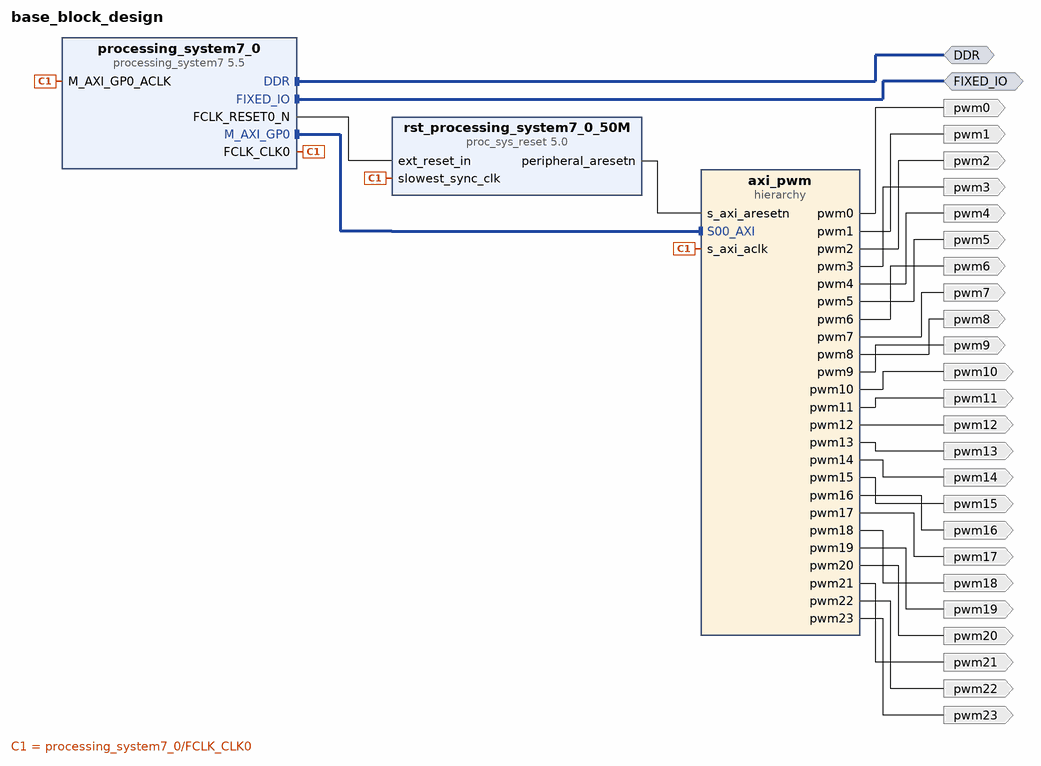
[diagram p0: block diagram of the top level]
# Vivado block design base_block_design, xc7z020clg400-3, Vivado 2018.2.1
create_bd_design base_block_design

create_bd_intf_port -mode Master -vlnv xilinx.com:interface:ddrx_rtl:1.0 DDR
create_bd_intf_port -mode Master -vlnv xilinx.com:display_processing_system7:fixedio_rtl:1.0 FIXED_IO
create_bd_port -dir O pwm0
create_bd_port -dir O pwm1
create_bd_port -dir O pwm2
create_bd_port -dir O pwm3
create_bd_port -dir O pwm4
create_bd_port -dir O pwm5
create_bd_port -dir O pwm6
create_bd_port -dir O pwm7
create_bd_port -dir O pwm8
create_bd_port -dir O pwm9
create_bd_port -dir O pwm10
create_bd_port -dir O pwm11
create_bd_port -dir O pwm12
create_bd_port -dir O pwm13
create_bd_port -dir O pwm14
create_bd_port -dir O pwm15
create_bd_port -dir O pwm16
create_bd_port -dir O pwm17
create_bd_port -dir O pwm18
create_bd_port -dir O pwm19
create_bd_port -dir O pwm20
create_bd_port -dir O pwm21
create_bd_port -dir O pwm22
create_bd_port -dir O pwm23

create_bd_cell -type hier axi_pwm
create_bd_cell -type ip -vlnv xilinx.com:ip:processing_system7:5.5 processing_system7_0
set_property -dict [list \
  CONFIG.PCW_UIPARAM_DDR_FREQ_MHZ 400 \
  CONFIG.PCW_CPU_CPU_6X4X_MAX_RANGE 867 \
  CONFIG.PCW_APU_PERIPHERAL_FREQMHZ 866.666666 \
  CONFIG.PCW_SDIO_PERIPHERAL_FREQMHZ 100 \
  CONFIG.PCW_UART_PERIPHERAL_FREQMHZ 100 \
  CONFIG.PCW_FPGA0_PERIPHERAL_FREQMHZ 50 \
  CONFIG.PCW_FPGA1_PERIPHERAL_FREQMHZ 50 \
  CONFIG.PCW_PERIPHERAL_BOARD_PRESET None \
  CONFIG.PCW_PRESET_BANK0_VOLTAGE {LVCMOS 1.8V} \
  CONFIG.PCW_PRESET_BANK1_VOLTAGE {LVCMOS 1.8V} \
  CONFIG.PCW_UIPARAM_DDR_MEMORY_TYPE {LPDDR 2} \
  CONFIG.PCW_UIPARAM_DDR_PARTNO Custom \
  CONFIG.PCW_QSPI_PERIPHERAL_ENABLE 1 \
  CONFIG.PCW_QSPI_QSPI_IO {MIO 1 .. 6} \
  CONFIG.PCW_QSPI_GRP_SINGLE_SS_ENABLE 1 \
  CONFIG.PCW_QSPI_GRP_SINGLE_SS_IO {MIO 1 .. 6} \
  CONFIG.PCW_SINGLE_QSPI_DATA_MODE NA \
  CONFIG.PCW_ENET0_PERIPHERAL_ENABLE 0 \
  CONFIG.PCW_SD0_PERIPHERAL_ENABLE 1 \
  CONFIG.PCW_SD0_SD0_IO {MIO 40 .. 45} \
  CONFIG.PCW_SD0_GRP_CD_ENABLE 0 \
  CONFIG.PCW_SD0_GRP_WP_ENABLE 0 \
  CONFIG.PCW_SD1_PERIPHERAL_ENABLE 1 \
  CONFIG.PCW_SD1_SD1_IO {MIO 10 .. 15} \
  CONFIG.PCW_UART0_PERIPHERAL_ENABLE 1 \
  CONFIG.PCW_UART0_UART0_IO {MIO 50 .. 51} \
  CONFIG.PCW_UART1_PERIPHERAL_ENABLE 0 \
  CONFIG.PCW_SPI1_PERIPHERAL_ENABLE 1 \
  CONFIG.PCW_SPI1_SPI1_IO {MIO 46 .. 51} \
  CONFIG.PCW_USB0_PERIPHERAL_ENABLE 0 \
  CONFIG.PCW_USB_RESET_ENABLE 1 \
  CONFIG.PCW_I2C_RESET_ENABLE 1 \
  CONFIG.PCW_GPIO_MIO_GPIO_ENABLE 1 \
  CONFIG.PCW_GPIO_MIO_GPIO_IO MIO \
  CONFIG.PCW_GPIO_EMIO_GPIO_ENABLE 1 \
  CONFIG.PCW_GPIO_EMIO_GPIO_IO 64 \
  CONFIG.PCW_UIPARAM_GENERATE_SUMMARY NONE \
] [get_bd_cells processing_system7_0]
# 510 more settings of processing_system7_0 are not shown: defaults, MIO pin electricals, DDR timing, and values the tool derives
create_bd_cell -type ip -vlnv xilinx.com:ip:proc_sys_reset:5.0 rst_processing_system7_0_50M

# ---- hierarchy /axi_pwm ----
current_bd_instance /axi_pwm
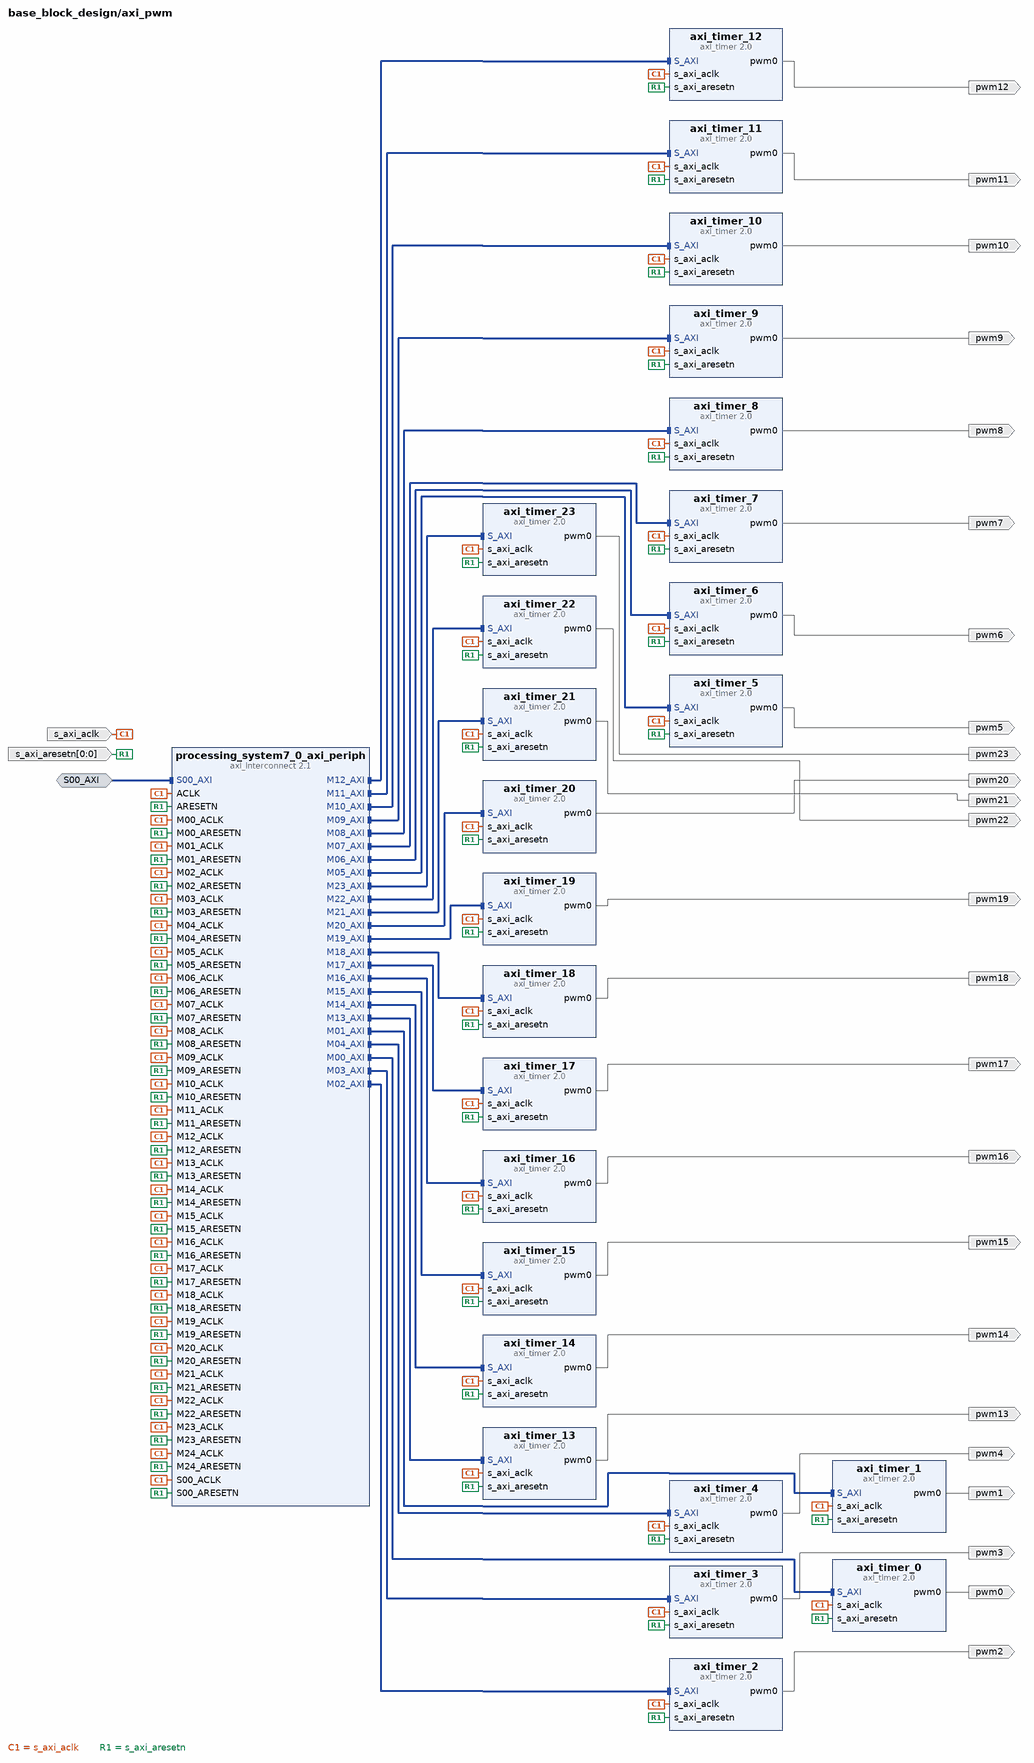
[diagram p1: block diagram inside /axi_pwm]
create_bd_intf_pin -mode Slave -vlnv xilinx.com:interface:aximm_rtl:1.0 S00_AXI
create_bd_pin -dir I -type clk s_axi_aclk
create_bd_pin -dir I -from 0 -to 0 -type rst s_axi_aresetn
create_bd_pin -dir O pwm0
create_bd_pin -dir O pwm1
create_bd_pin -dir O pwm2
create_bd_pin -dir O pwm3
create_bd_pin -dir O pwm10
create_bd_pin -dir O pwm11
create_bd_pin -dir O pwm12
create_bd_pin -dir O pwm13
create_bd_pin -dir O pwm14
create_bd_pin -dir O pwm15
create_bd_pin -dir O pwm16
create_bd_pin -dir O pwm17
create_bd_pin -dir O pwm18
create_bd_pin -dir O pwm19
create_bd_pin -dir O pwm20
create_bd_pin -dir O pwm21
create_bd_pin -dir O pwm4
create_bd_pin -dir O pwm5
create_bd_pin -dir O pwm6
create_bd_pin -dir O pwm22
create_bd_pin -dir O pwm23
create_bd_pin -dir O pwm7
create_bd_pin -dir O pwm8
create_bd_pin -dir O pwm9

create_bd_cell -type ip -vlnv xilinx.com:ip:axi_timer:2.0 axi_timer_6
create_bd_cell -type ip -vlnv xilinx.com:ip:axi_timer:2.0 axi_timer_7
create_bd_cell -type ip -vlnv xilinx.com:ip:axi_timer:2.0 axi_timer_8
create_bd_cell -type ip -vlnv xilinx.com:ip:axi_timer:2.0 axi_timer_9
create_bd_cell -type ip -vlnv xilinx.com:ip:axi_timer:2.0 axi_timer_10
create_bd_cell -type ip -vlnv xilinx.com:ip:axi_timer:2.0 axi_timer_11
create_bd_cell -type ip -vlnv xilinx.com:ip:axi_timer:2.0 axi_timer_12
create_bd_cell -type ip -vlnv xilinx.com:ip:axi_timer:2.0 axi_timer_13
create_bd_cell -type ip -vlnv xilinx.com:ip:axi_timer:2.0 axi_timer_14
create_bd_cell -type ip -vlnv xilinx.com:ip:axi_timer:2.0 axi_timer_15
create_bd_cell -type ip -vlnv xilinx.com:ip:axi_timer:2.0 axi_timer_16
create_bd_cell -type ip -vlnv xilinx.com:ip:axi_timer:2.0 axi_timer_17
create_bd_cell -type ip -vlnv xilinx.com:ip:axi_timer:2.0 axi_timer_18
create_bd_cell -type ip -vlnv xilinx.com:ip:axi_timer:2.0 axi_timer_19
create_bd_cell -type ip -vlnv xilinx.com:ip:axi_timer:2.0 axi_timer_20
create_bd_cell -type ip -vlnv xilinx.com:ip:axi_timer:2.0 axi_timer_21
create_bd_cell -type ip -vlnv xilinx.com:ip:axi_timer:2.0 axi_timer_22
create_bd_cell -type ip -vlnv xilinx.com:ip:axi_timer:2.0 axi_timer_23
create_bd_cell -type ip -vlnv xilinx.com:ip:axi_timer:2.0 axi_timer_0
create_bd_cell -type ip -vlnv xilinx.com:ip:axi_timer:2.0 axi_timer_1
create_bd_cell -type ip -vlnv xilinx.com:ip:axi_timer:2.0 axi_timer_2
create_bd_cell -type ip -vlnv xilinx.com:ip:axi_timer:2.0 axi_timer_3
create_bd_cell -type ip -vlnv xilinx.com:ip:axi_timer:2.0 axi_timer_4
create_bd_cell -type ip -vlnv xilinx.com:ip:axi_timer:2.0 axi_timer_5
create_bd_cell -type ip -vlnv xilinx.com:ip:axi_interconnect:2.1 processing_system7_0_axi_periph
set_property -dict [list \
  CONFIG.NUM_SI 1 \
  CONFIG.NUM_MI 25 \
  CONFIG.SYNCHRONIZATION_STAGES 2 \
] [get_bd_cells processing_system7_0_axi_periph]

# ---- connections ----

current_bd_instance /axi_pwm
connect_bd_intf_net [get_bd_intf_pins axi_timer_0/S_AXI] [get_bd_intf_pins processing_system7_0_axi_periph/M00_AXI]
connect_bd_intf_net [get_bd_intf_pins axi_timer_1/S_AXI] [get_bd_intf_pins processing_system7_0_axi_periph/M01_AXI]
connect_bd_intf_net [get_bd_intf_pins axi_timer_2/S_AXI] [get_bd_intf_pins processing_system7_0_axi_periph/M02_AXI]
connect_bd_intf_net [get_bd_intf_pins axi_timer_3/S_AXI] [get_bd_intf_pins processing_system7_0_axi_periph/M03_AXI]
connect_bd_intf_net [get_bd_intf_pins axi_timer_4/S_AXI] [get_bd_intf_pins processing_system7_0_axi_periph/M04_AXI]
connect_bd_intf_net [get_bd_intf_pins axi_timer_5/S_AXI] [get_bd_intf_pins processing_system7_0_axi_periph/M05_AXI]
connect_bd_intf_net [get_bd_intf_pins processing_system7_0_axi_periph/M06_AXI] [get_bd_intf_pins axi_timer_6/S_AXI]
connect_bd_intf_net [get_bd_intf_pins axi_timer_7/S_AXI] [get_bd_intf_pins processing_system7_0_axi_periph/M07_AXI]
connect_bd_intf_net [get_bd_intf_pins axi_timer_8/S_AXI] [get_bd_intf_pins processing_system7_0_axi_periph/M08_AXI]
connect_bd_intf_net [get_bd_intf_pins axi_timer_9/S_AXI] [get_bd_intf_pins processing_system7_0_axi_periph/M09_AXI]
connect_bd_intf_net [get_bd_intf_pins axi_timer_10/S_AXI] [get_bd_intf_pins processing_system7_0_axi_periph/M10_AXI]
connect_bd_intf_net [get_bd_intf_pins axi_timer_11/S_AXI] [get_bd_intf_pins processing_system7_0_axi_periph/M11_AXI]
connect_bd_intf_net [get_bd_intf_pins axi_timer_12/S_AXI] [get_bd_intf_pins processing_system7_0_axi_periph/M12_AXI]
connect_bd_intf_net [get_bd_intf_pins axi_timer_13/S_AXI] [get_bd_intf_pins processing_system7_0_axi_periph/M13_AXI]
connect_bd_intf_net [get_bd_intf_pins axi_timer_14/S_AXI] [get_bd_intf_pins processing_system7_0_axi_periph/M14_AXI]
connect_bd_intf_net [get_bd_intf_pins axi_timer_15/S_AXI] [get_bd_intf_pins processing_system7_0_axi_periph/M15_AXI]
connect_bd_intf_net [get_bd_intf_pins axi_timer_16/S_AXI] [get_bd_intf_pins processing_system7_0_axi_periph/M16_AXI]
connect_bd_intf_net [get_bd_intf_pins axi_timer_17/S_AXI] [get_bd_intf_pins processing_system7_0_axi_periph/M17_AXI]
connect_bd_intf_net [get_bd_intf_pins axi_timer_18/S_AXI] [get_bd_intf_pins processing_system7_0_axi_periph/M18_AXI]
connect_bd_intf_net [get_bd_intf_pins axi_timer_19/S_AXI] [get_bd_intf_pins processing_system7_0_axi_periph/M19_AXI]
connect_bd_intf_net [get_bd_intf_pins axi_timer_20/S_AXI] [get_bd_intf_pins processing_system7_0_axi_periph/M20_AXI]
connect_bd_intf_net [get_bd_intf_pins axi_timer_21/S_AXI] [get_bd_intf_pins processing_system7_0_axi_periph/M21_AXI]
connect_bd_intf_net [get_bd_intf_pins axi_timer_22/S_AXI] [get_bd_intf_pins processing_system7_0_axi_periph/M22_AXI]
connect_bd_intf_net [get_bd_intf_pins axi_timer_23/S_AXI] [get_bd_intf_pins processing_system7_0_axi_periph/M23_AXI]
connect_bd_intf_net [get_bd_intf_pins S00_AXI] [get_bd_intf_pins processing_system7_0_axi_periph/S00_AXI]
connect_bd_net [get_bd_pins s_axi_aclk] \
  [get_bd_pins axi_timer_6/s_axi_aclk] [get_bd_pins axi_timer_7/s_axi_aclk] [get_bd_pins axi_timer_8/s_axi_aclk] \
  [get_bd_pins axi_timer_9/s_axi_aclk] [get_bd_pins axi_timer_10/s_axi_aclk] [get_bd_pins axi_timer_11/s_axi_aclk] \
  [get_bd_pins axi_timer_12/s_axi_aclk] [get_bd_pins axi_timer_13/s_axi_aclk] [get_bd_pins axi_timer_14/s_axi_aclk] \
  [get_bd_pins axi_timer_15/s_axi_aclk] [get_bd_pins axi_timer_16/s_axi_aclk] [get_bd_pins axi_timer_17/s_axi_aclk] \
  [get_bd_pins axi_timer_18/s_axi_aclk] [get_bd_pins axi_timer_19/s_axi_aclk] [get_bd_pins axi_timer_20/s_axi_aclk] \
  [get_bd_pins axi_timer_21/s_axi_aclk] [get_bd_pins axi_timer_22/s_axi_aclk] [get_bd_pins axi_timer_23/s_axi_aclk] \
  [get_bd_pins axi_timer_0/s_axi_aclk] [get_bd_pins axi_timer_1/s_axi_aclk] [get_bd_pins axi_timer_2/s_axi_aclk] \
  [get_bd_pins axi_timer_3/s_axi_aclk] [get_bd_pins axi_timer_4/s_axi_aclk] [get_bd_pins axi_timer_5/s_axi_aclk] \
  [get_bd_pins processing_system7_0_axi_periph/ACLK] [get_bd_pins processing_system7_0_axi_periph/S00_ACLK] \
  [get_bd_pins processing_system7_0_axi_periph/M00_ACLK] [get_bd_pins processing_system7_0_axi_periph/M01_ACLK] \
  [get_bd_pins processing_system7_0_axi_periph/M02_ACLK] [get_bd_pins processing_system7_0_axi_periph/M03_ACLK] \
  [get_bd_pins processing_system7_0_axi_periph/M04_ACLK] [get_bd_pins processing_system7_0_axi_periph/M05_ACLK] \
  [get_bd_pins processing_system7_0_axi_periph/M06_ACLK] [get_bd_pins processing_system7_0_axi_periph/M07_ACLK] \
  [get_bd_pins processing_system7_0_axi_periph/M08_ACLK] [get_bd_pins processing_system7_0_axi_periph/M09_ACLK] \
  [get_bd_pins processing_system7_0_axi_periph/M10_ACLK] [get_bd_pins processing_system7_0_axi_periph/M11_ACLK] \
  [get_bd_pins processing_system7_0_axi_periph/M12_ACLK] [get_bd_pins processing_system7_0_axi_periph/M13_ACLK] \
  [get_bd_pins processing_system7_0_axi_periph/M14_ACLK] [get_bd_pins processing_system7_0_axi_periph/M15_ACLK] \
  [get_bd_pins processing_system7_0_axi_periph/M16_ACLK] [get_bd_pins processing_system7_0_axi_periph/M17_ACLK] \
  [get_bd_pins processing_system7_0_axi_periph/M18_ACLK] [get_bd_pins processing_system7_0_axi_periph/M19_ACLK] \
  [get_bd_pins processing_system7_0_axi_periph/M20_ACLK] [get_bd_pins processing_system7_0_axi_periph/M21_ACLK] \
  [get_bd_pins processing_system7_0_axi_periph/M22_ACLK] [get_bd_pins processing_system7_0_axi_periph/M23_ACLK] \
  [get_bd_pins processing_system7_0_axi_periph/M24_ACLK]
connect_bd_net [get_bd_pins s_axi_aresetn] \
  [get_bd_pins axi_timer_6/s_axi_aresetn] [get_bd_pins axi_timer_7/s_axi_aresetn] [get_bd_pins axi_timer_8/s_axi_aresetn] \
  [get_bd_pins axi_timer_9/s_axi_aresetn] [get_bd_pins axi_timer_10/s_axi_aresetn] [get_bd_pins axi_timer_11/s_axi_aresetn] \
  [get_bd_pins axi_timer_12/s_axi_aresetn] [get_bd_pins axi_timer_13/s_axi_aresetn] [get_bd_pins axi_timer_14/s_axi_aresetn] \
  [get_bd_pins axi_timer_15/s_axi_aresetn] [get_bd_pins axi_timer_16/s_axi_aresetn] [get_bd_pins axi_timer_17/s_axi_aresetn] \
  [get_bd_pins axi_timer_18/s_axi_aresetn] [get_bd_pins axi_timer_19/s_axi_aresetn] [get_bd_pins axi_timer_20/s_axi_aresetn] \
  [get_bd_pins axi_timer_21/s_axi_aresetn] [get_bd_pins axi_timer_22/s_axi_aresetn] [get_bd_pins axi_timer_23/s_axi_aresetn] \
  [get_bd_pins axi_timer_0/s_axi_aresetn] [get_bd_pins axi_timer_1/s_axi_aresetn] [get_bd_pins axi_timer_2/s_axi_aresetn] \
  [get_bd_pins axi_timer_3/s_axi_aresetn] [get_bd_pins axi_timer_4/s_axi_aresetn] [get_bd_pins axi_timer_5/s_axi_aresetn] \
  [get_bd_pins processing_system7_0_axi_periph/ARESETN] [get_bd_pins processing_system7_0_axi_periph/S00_ARESETN] \
  [get_bd_pins processing_system7_0_axi_periph/M00_ARESETN] [get_bd_pins processing_system7_0_axi_periph/M01_ARESETN] \
  [get_bd_pins processing_system7_0_axi_periph/M02_ARESETN] [get_bd_pins processing_system7_0_axi_periph/M03_ARESETN] \
  [get_bd_pins processing_system7_0_axi_periph/M04_ARESETN] [get_bd_pins processing_system7_0_axi_periph/M05_ARESETN] \
  [get_bd_pins processing_system7_0_axi_periph/M06_ARESETN] [get_bd_pins processing_system7_0_axi_periph/M07_ARESETN] \
  [get_bd_pins processing_system7_0_axi_periph/M08_ARESETN] [get_bd_pins processing_system7_0_axi_periph/M09_ARESETN] \
  [get_bd_pins processing_system7_0_axi_periph/M10_ARESETN] [get_bd_pins processing_system7_0_axi_periph/M11_ARESETN] \
  [get_bd_pins processing_system7_0_axi_periph/M12_ARESETN] [get_bd_pins processing_system7_0_axi_periph/M13_ARESETN] \
  [get_bd_pins processing_system7_0_axi_periph/M14_ARESETN] [get_bd_pins processing_system7_0_axi_periph/M15_ARESETN] \
  [get_bd_pins processing_system7_0_axi_periph/M16_ARESETN] [get_bd_pins processing_system7_0_axi_periph/M17_ARESETN] \
  [get_bd_pins processing_system7_0_axi_periph/M18_ARESETN] [get_bd_pins processing_system7_0_axi_periph/M19_ARESETN] \
  [get_bd_pins processing_system7_0_axi_periph/M20_ARESETN] [get_bd_pins processing_system7_0_axi_periph/M21_ARESETN] \
  [get_bd_pins processing_system7_0_axi_periph/M22_ARESETN] [get_bd_pins processing_system7_0_axi_periph/M23_ARESETN] \
  [get_bd_pins processing_system7_0_axi_periph/M24_ARESETN]
connect_bd_net [get_bd_pins axi_timer_0/pwm0] [get_bd_pins pwm0]
connect_bd_net [get_bd_pins axi_timer_1/pwm0] [get_bd_pins pwm1]
connect_bd_net [get_bd_pins axi_timer_2/pwm0] [get_bd_pins pwm2]
connect_bd_net [get_bd_pins axi_timer_3/pwm0] [get_bd_pins pwm3]
connect_bd_net [get_bd_pins axi_timer_10/pwm0] [get_bd_pins pwm10]
connect_bd_net [get_bd_pins axi_timer_11/pwm0] [get_bd_pins pwm11]
connect_bd_net [get_bd_pins axi_timer_12/pwm0] [get_bd_pins pwm12]
connect_bd_net [get_bd_pins axi_timer_13/pwm0] [get_bd_pins pwm13]
connect_bd_net [get_bd_pins axi_timer_14/pwm0] [get_bd_pins pwm14]
connect_bd_net [get_bd_pins axi_timer_15/pwm0] [get_bd_pins pwm15]
connect_bd_net [get_bd_pins axi_timer_16/pwm0] [get_bd_pins pwm16]
connect_bd_net [get_bd_pins axi_timer_17/pwm0] [get_bd_pins pwm17]
connect_bd_net [get_bd_pins axi_timer_18/pwm0] [get_bd_pins pwm18]
connect_bd_net [get_bd_pins axi_timer_19/pwm0] [get_bd_pins pwm19]
connect_bd_net [get_bd_pins axi_timer_20/pwm0] [get_bd_pins pwm20]
connect_bd_net [get_bd_pins axi_timer_21/pwm0] [get_bd_pins pwm21]
connect_bd_net [get_bd_pins axi_timer_4/pwm0] [get_bd_pins pwm4]
connect_bd_net [get_bd_pins axi_timer_5/pwm0] [get_bd_pins pwm5]
connect_bd_net [get_bd_pins axi_timer_6/pwm0] [get_bd_pins pwm6]
connect_bd_net [get_bd_pins axi_timer_22/pwm0] [get_bd_pins pwm22]
connect_bd_net [get_bd_pins axi_timer_23/pwm0] [get_bd_pins pwm23]
connect_bd_net [get_bd_pins axi_timer_7/pwm0] [get_bd_pins pwm7]
connect_bd_net [get_bd_pins axi_timer_8/pwm0] [get_bd_pins pwm8]
connect_bd_net [get_bd_pins axi_timer_9/pwm0] [get_bd_pins pwm9]

current_bd_instance /
connect_bd_intf_net [get_bd_intf_pins axi_pwm/S00_AXI] [get_bd_intf_pins processing_system7_0/M_AXI_GP0]
connect_bd_intf_net [get_bd_intf_ports DDR] [get_bd_intf_pins processing_system7_0/DDR]
connect_bd_intf_net [get_bd_intf_ports FIXED_IO] [get_bd_intf_pins processing_system7_0/FIXED_IO]
connect_bd_net [get_bd_pins processing_system7_0/FCLK_CLK0] \
  [get_bd_pins axi_pwm/s_axi_aclk] [get_bd_pins processing_system7_0/M_AXI_GP0_ACLK] \
  [get_bd_pins rst_processing_system7_0_50M/slowest_sync_clk]
connect_bd_net [get_bd_pins processing_system7_0/FCLK_RESET0_N] [get_bd_pins rst_processing_system7_0_50M/ext_reset_in]
connect_bd_net [get_bd_pins rst_processing_system7_0_50M/peripheral_aresetn] [get_bd_pins axi_pwm/s_axi_aresetn]
connect_bd_net [get_bd_pins axi_pwm/pwm0] [get_bd_ports pwm0]
connect_bd_net [get_bd_pins axi_pwm/pwm1] [get_bd_ports pwm1]
connect_bd_net [get_bd_pins axi_pwm/pwm2] [get_bd_ports pwm2]
connect_bd_net [get_bd_pins axi_pwm/pwm3] [get_bd_ports pwm3]
connect_bd_net [get_bd_pins axi_pwm/pwm4] [get_bd_ports pwm4]
connect_bd_net [get_bd_pins axi_pwm/pwm5] [get_bd_ports pwm5]
connect_bd_net [get_bd_pins axi_pwm/pwm6] [get_bd_ports pwm6]
connect_bd_net [get_bd_pins axi_pwm/pwm7] [get_bd_ports pwm7]
connect_bd_net [get_bd_pins axi_pwm/pwm8] [get_bd_ports pwm8]
connect_bd_net [get_bd_pins axi_pwm/pwm9] [get_bd_ports pwm9]
connect_bd_net [get_bd_pins axi_pwm/pwm10] [get_bd_ports pwm10]
connect_bd_net [get_bd_pins axi_pwm/pwm11] [get_bd_ports pwm11]
connect_bd_net [get_bd_pins axi_pwm/pwm12] [get_bd_ports pwm12]
connect_bd_net [get_bd_pins axi_pwm/pwm13] [get_bd_ports pwm13]
connect_bd_net [get_bd_pins axi_pwm/pwm14] [get_bd_ports pwm14]
connect_bd_net [get_bd_pins axi_pwm/pwm15] [get_bd_ports pwm15]
connect_bd_net [get_bd_pins axi_pwm/pwm16] [get_bd_ports pwm16]
connect_bd_net [get_bd_pins axi_pwm/pwm17] [get_bd_ports pwm17]
connect_bd_net [get_bd_pins axi_pwm/pwm18] [get_bd_ports pwm18]
connect_bd_net [get_bd_pins axi_pwm/pwm19] [get_bd_ports pwm19]
connect_bd_net [get_bd_pins axi_pwm/pwm20] [get_bd_ports pwm20]
connect_bd_net [get_bd_pins axi_pwm/pwm21] [get_bd_ports pwm21]
connect_bd_net [get_bd_pins axi_pwm/pwm22] [get_bd_ports pwm22]
connect_bd_net [get_bd_pins axi_pwm/pwm23] [get_bd_ports pwm23]

# ---- address map ----
assign_bd_address -offset 0x42800000 -range 64K -target_address_space [get_bd_addr_spaces processing_system7_0/Data] [get_bd_addr_segs axi_pwm/axi_timer_0/S_AXI/Reg]
assign_bd_address -offset 0x42810000 -range 64K -target_address_space [get_bd_addr_spaces processing_system7_0/Data] [get_bd_addr_segs axi_pwm/axi_timer_1/S_AXI/Reg]
assign_bd_address -offset 0x42820000 -range 64K -target_address_space [get_bd_addr_spaces processing_system7_0/Data] [get_bd_addr_segs axi_pwm/axi_timer_2/S_AXI/Reg]
assign_bd_address -offset 0x42830000 -range 64K -target_address_space [get_bd_addr_spaces processing_system7_0/Data] [get_bd_addr_segs axi_pwm/axi_timer_3/S_AXI/Reg]
assign_bd_address -offset 0x42840000 -range 64K -target_address_space [get_bd_addr_spaces processing_system7_0/Data] [get_bd_addr_segs axi_pwm/axi_timer_4/S_AXI/Reg]
assign_bd_address -offset 0x42850000 -range 64K -target_address_space [get_bd_addr_spaces processing_system7_0/Data] [get_bd_addr_segs axi_pwm/axi_timer_5/S_AXI/Reg]
assign_bd_address -offset 0x42860000 -range 64K -target_address_space [get_bd_addr_spaces processing_system7_0/Data] [get_bd_addr_segs axi_pwm/axi_timer_6/S_AXI/Reg]
assign_bd_address -offset 0x42870000 -range 64K -target_address_space [get_bd_addr_spaces processing_system7_0/Data] [get_bd_addr_segs axi_pwm/axi_timer_7/S_AXI/Reg]
assign_bd_address -offset 0x42880000 -range 64K -target_address_space [get_bd_addr_spaces processing_system7_0/Data] [get_bd_addr_segs axi_pwm/axi_timer_8/S_AXI/Reg]
assign_bd_address -offset 0x42890000 -range 64K -target_address_space [get_bd_addr_spaces processing_system7_0/Data] [get_bd_addr_segs axi_pwm/axi_timer_9/S_AXI/Reg]
assign_bd_address -offset 0x428A0000 -range 64K -target_address_space [get_bd_addr_spaces processing_system7_0/Data] [get_bd_addr_segs axi_pwm/axi_timer_10/S_AXI/Reg]
assign_bd_address -offset 0x428B0000 -range 64K -target_address_space [get_bd_addr_spaces processing_system7_0/Data] [get_bd_addr_segs axi_pwm/axi_timer_11/S_AXI/Reg]
assign_bd_address -offset 0x428C0000 -range 64K -target_address_space [get_bd_addr_spaces processing_system7_0/Data] [get_bd_addr_segs axi_pwm/axi_timer_12/S_AXI/Reg]
assign_bd_address -offset 0x428D0000 -range 64K -target_address_space [get_bd_addr_spaces processing_system7_0/Data] [get_bd_addr_segs axi_pwm/axi_timer_13/S_AXI/Reg]
assign_bd_address -offset 0x428E0000 -range 64K -target_address_space [get_bd_addr_spaces processing_system7_0/Data] [get_bd_addr_segs axi_pwm/axi_timer_14/S_AXI/Reg]
assign_bd_address -offset 0x428F0000 -range 64K -target_address_space [get_bd_addr_spaces processing_system7_0/Data] [get_bd_addr_segs axi_pwm/axi_timer_15/S_AXI/Reg]
assign_bd_address -offset 0x42900000 -range 64K -target_address_space [get_bd_addr_spaces processing_system7_0/Data] [get_bd_addr_segs axi_pwm/axi_timer_16/S_AXI/Reg]
assign_bd_address -offset 0x42910000 -range 64K -target_address_space [get_bd_addr_spaces processing_system7_0/Data] [get_bd_addr_segs axi_pwm/axi_timer_17/S_AXI/Reg]
assign_bd_address -offset 0x42920000 -range 64K -target_address_space [get_bd_addr_spaces processing_system7_0/Data] [get_bd_addr_segs axi_pwm/axi_timer_18/S_AXI/Reg]
assign_bd_address -offset 0x42930000 -range 64K -target_address_space [get_bd_addr_spaces processing_system7_0/Data] [get_bd_addr_segs axi_pwm/axi_timer_19/S_AXI/Reg]
assign_bd_address -offset 0x42940000 -range 64K -target_address_space [get_bd_addr_spaces processing_system7_0/Data] [get_bd_addr_segs axi_pwm/axi_timer_20/S_AXI/Reg]
assign_bd_address -offset 0x42950000 -range 64K -target_address_space [get_bd_addr_spaces processing_system7_0/Data] [get_bd_addr_segs axi_pwm/axi_timer_21/S_AXI/Reg]
assign_bd_address -offset 0x42960000 -range 64K -target_address_space [get_bd_addr_spaces processing_system7_0/Data] [get_bd_addr_segs axi_pwm/axi_timer_22/S_AXI/Reg]
assign_bd_address -offset 0x42970000 -range 64K -target_address_space [get_bd_addr_spaces processing_system7_0/Data] [get_bd_addr_segs axi_pwm/axi_timer_23/S_AXI/Reg]

validate_bd_design
save_bd_design
